# Altium schematic sheet Mainboard_Motordriver_Interface.SchDoc
size A4
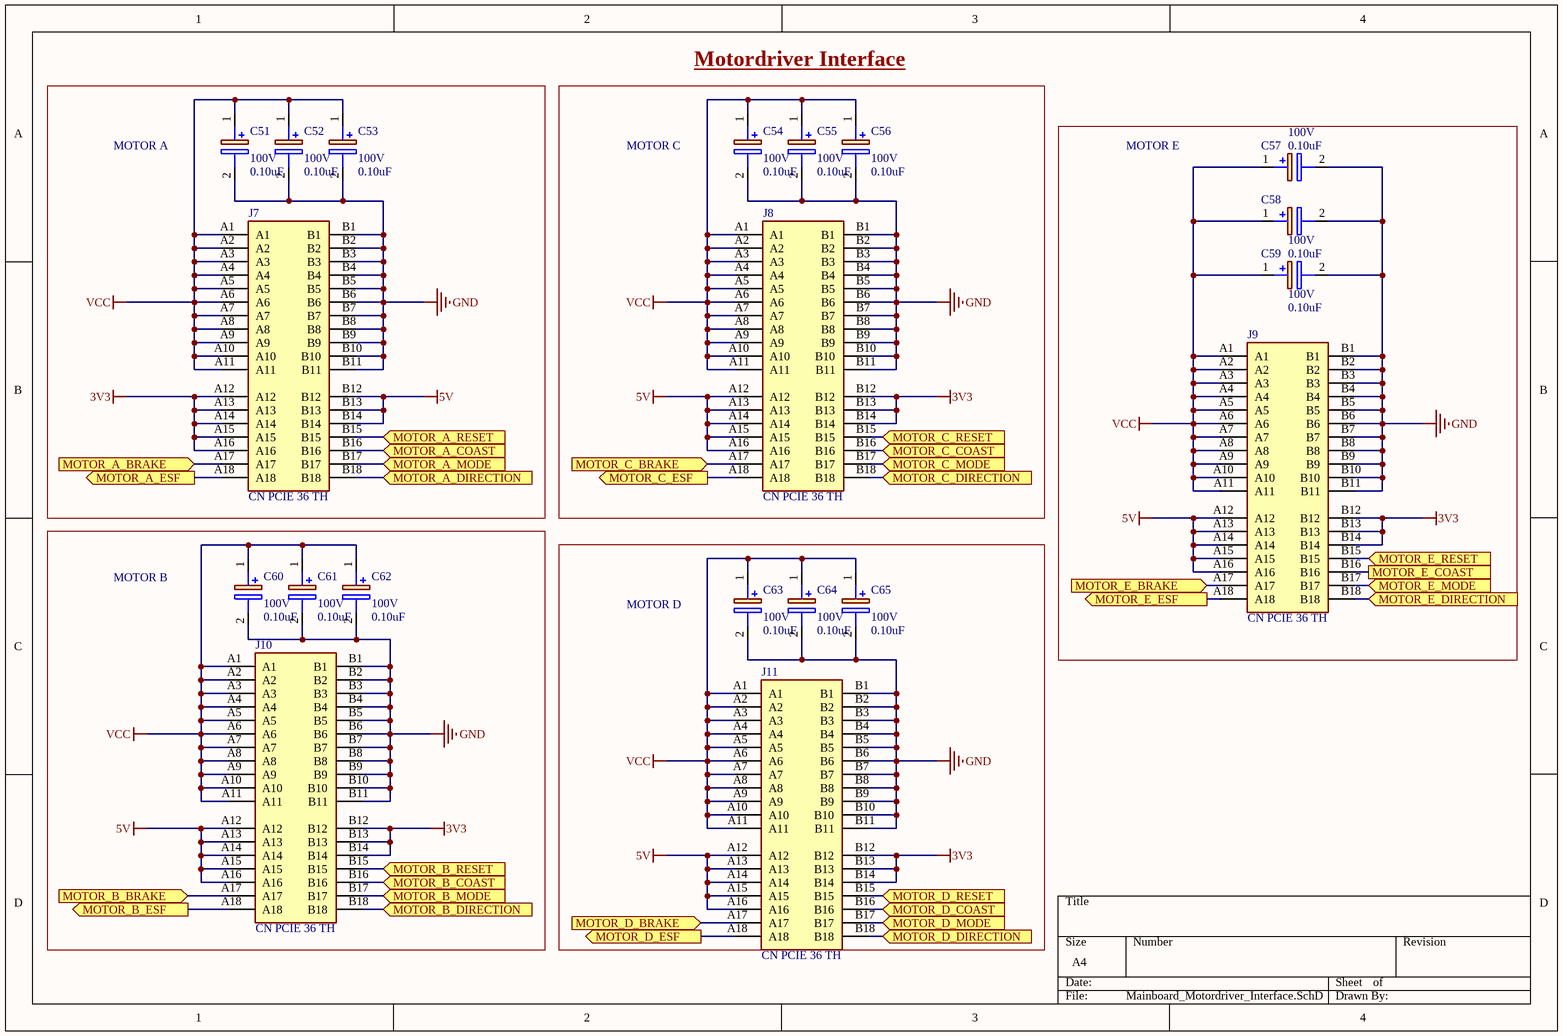
[diagram p0: Mainboard_Motordriver_Interface.SchDoc]

## Parts
C51  value 0.10uF  Rating: 100V  [0603]  (hidden comment: CAP POL 0.1uF 100V)
C52  value 0.10uF  Rating: 100V  [0603]  (hidden comment: CAP POL 0.1uF 100V)
C53  value 0.10uF  Rating: 100V  [0603]  (hidden comment: CAP POL 0.1uF 100V)
C54  value 0.10uF  Rating: 100V  [0603]  (hidden comment: CAP POL 0.1uF 100V)
C55  value 0.10uF  Rating: 100V  [0603]  (hidden comment: CAP POL 0.1uF 100V)
C56  value 0.10uF  Rating: 100V  [0603]  (hidden comment: CAP POL 0.1uF 100V)
C57  value 0.10uF  Rating: 100V  [0603]  (hidden comment: CAP POL 0.1uF 100V)
C58  value 0.10uF  Rating: 100V  [0603]  (hidden comment: CAP POL 0.1uF 100V)
C59  value 0.10uF  Rating: 100V  [0603]  (hidden comment: CAP POL 0.1uF 100V)
C60  value 0.10uF  Rating: 100V  [0603]  (hidden comment: CAP POL 0.1uF 100V)
C61  value 0.10uF  Rating: 100V  [0603]  (hidden comment: CAP POL 0.1uF 100V)
C62  value 0.10uF  Rating: 100V  [0603]  (hidden comment: CAP POL 0.1uF 100V)
C63  value 0.10uF  Rating: 100V  [0603]  (hidden comment: CAP POL 0.1uF 100V)
C64  value 0.10uF  Rating: 100V  [0603]  (hidden comment: CAP POL 0.1uF 100V)
C65  value 0.10uF  Rating: 100V  [0603]  (hidden comment: CAP POL 0.1uF 100V)
J7  CN PCIE 36 TH  [CN PCIE 36 TH]
J8  CN PCIE 36 TH  [CN PCIE 36 TH]
J9  CN PCIE 36 TH  [CN PCIE 36 TH]
J10  CN PCIE 36 TH  [CN PCIE 36 TH]
J11  CN PCIE 36 TH  [CN PCIE 36 TH]

## Blocks framed on the sheet
MOTOR A: C51-C53 J7
Motordriver Interface: C54-C56 J8
MOTOR E: C57-C59 J9
MOTOR B: C60-C62 J10
MOTOR D: C63-C65 J11

## Ports
MOTOR_A_BRAKE (in), MOTOR_A_COAST (in), MOTOR_A_DIRECTION (in), MOTOR_A_ESF (out), MOTOR_A_MODE (in), MOTOR_A_RESET (in), MOTOR_B_BRAKE (in), MOTOR_B_COAST (in), MOTOR_B_DIRECTION (in), MOTOR_B_ESF (out), MOTOR_B_MODE (in), MOTOR_B_RESET (in), MOTOR_C_BRAKE (in), MOTOR_C_COAST (in), MOTOR_C_DIRECTION (in), MOTOR_C_ESF (out), MOTOR_C_MODE (in), MOTOR_C_RESET (in), MOTOR_D_BRAKE (in), MOTOR_D_COAST (in), MOTOR_D_DIRECTION (in), MOTOR_D_ESF (out), MOTOR_D_MODE (in), MOTOR_D_RESET (in), MOTOR_E_BRAKE (in), MOTOR_E_COAST, MOTOR_E_DIRECTION (in), MOTOR_E_ESF (out), MOTOR_E_MODE (in), MOTOR_E_RESET (in)

## Nets
3V3: J7.A12 J7.A13 J7.A14 J7.A15 J7.A16 J8.B12 J8.B13 J8.B14 J9.B12 J9.B13 J9.B14 J10.B12 J10.B13 J10.B14 J11.B12 J11.B13 J11.B14
5V: J7.B12 J7.B13 J7.B14 J8.A12 J8.A13 J8.A14 J8.A15 J8.A16 J9.A12 J9.A13 J9.A14 J9.A15 J9.A16 J10.A12 J10.A13 J10.A14 J10.A15 J10.A16 J11.A12 J11.A13 J11.A14 J11.A15 J11.A16
GND: C51.2(-) C52.2(-) C53.2(-) C54.2(-) C55.2(-) C56.2(-) C57.2(-) C58.2(-) C59.2(-) C60.2(-) C61.2(-) C62.2(-) C63.2(-) C64.2(-) C65.2(-) J7.B1 J7.B2 J7.B3 J7.B4 J7.B5 J7.B6 J7.B7 J7.B8 J7.B9 J7.B10 J7.B11 J8.B1 J8.B2 J8.B3 J8.B4 J8.B5 J8.B6 J8.B7 J8.B8 J8.B9 J8.B10 J8.B11 J9.B1 J9.B2 J9.B3 J9.B4 J9.B5 J9.B6 J9.B7 J9.B8 J9.B9 J9.B10 J9.B11 J10.B1 J10.B2 J10.B3 J10.B4 J10.B5 J10.B6 J10.B7 J10.B8 J10.B9 J10.B10 J10.B11 J11.B1 J11.B2 J11.B3 J11.B4 J11.B5 J11.B6 J11.B7 J11.B8 J11.B9 J11.B10 J11.B11
VCC: C51.1(+) C52.1(+) C53.1(+) C54.1(+) C55.1(+) C56.1(+) C57.1(+) C58.1(+) C59.1(+) C60.1(+) C61.1(+) C62.1(+) C63.1(+) C64.1(+) C65.1(+) J7.A1 J7.A2 J7.A3 J7.A4 J7.A5 J7.A6 J7.A7 J7.A8 J7.A9 J7.A10 J7.A11 J8.A1 J8.A2 J8.A3 J8.A4 J8.A5 J8.A6 J8.A7 J8.A8 J8.A9 J8.A10 J8.A11 J9.A1 J9.A2 J9.A3 J9.A4 J9.A5 J9.A6 J9.A7 J9.A8 J9.A9 J9.A10 J9.A11 J10.A1 J10.A2 J10.A3 J10.A4 J10.A5 J10.A6 J10.A7 J10.A8 J10.A9 J10.A10 J10.A11 J11.A1 J11.A2 J11.A3 J11.A4 J11.A5 J11.A6 J11.A7 J11.A8 J11.A9 J11.A10 J11.A11
MOTOR_A_BRAKE: J7.A17 ; port MOTOR_A_BRAKE
MOTOR_A_COAST: J7.B16 ; port MOTOR_A_COAST
MOTOR_A_DIRECTION: J7.B18 ; port MOTOR_A_DIRECTION
MOTOR_A_ESF: J7.A18 ; port MOTOR_A_ESF
MOTOR_A_MODE: J7.B17 ; port MOTOR_A_MODE
MOTOR_A_RESET: J7.B15 ; port MOTOR_A_RESET
MOTOR_B_BRAKE: J10.A17 ; port MOTOR_B_BRAKE
MOTOR_B_COAST: J10.B16 ; port MOTOR_B_COAST
MOTOR_B_DIRECTION: J10.B18 ; port MOTOR_B_DIRECTION
MOTOR_B_ESF: J10.A18 ; port MOTOR_B_ESF
MOTOR_B_MODE: J10.B17 ; port MOTOR_B_MODE
MOTOR_B_RESET: J10.B15 ; port MOTOR_B_RESET
MOTOR_C_BRAKE: J8.A17 ; port MOTOR_C_BRAKE
MOTOR_C_COAST: J8.B16 ; port MOTOR_C_COAST
MOTOR_C_DIRECTION: J8.B18 ; port MOTOR_C_DIRECTION
MOTOR_C_ESF: J8.A18 ; port MOTOR_C_ESF
MOTOR_C_MODE: J8.B17 ; port MOTOR_C_MODE
MOTOR_C_RESET: J8.B15 ; port MOTOR_C_RESET
MOTOR_D_BRAKE: J11.A17 ; port MOTOR_D_BRAKE
MOTOR_D_COAST: J11.B16 ; port MOTOR_D_COAST
MOTOR_D_DIRECTION: J11.B18 ; port MOTOR_D_DIRECTION
MOTOR_D_ESF: J11.A18 ; port MOTOR_D_ESF
MOTOR_D_MODE: J11.B17 ; port MOTOR_D_MODE
MOTOR_D_RESET: J11.B15 ; port MOTOR_D_RESET
MOTOR_E_BRAKE: J9.A17 ; port MOTOR_E_BRAKE
MOTOR_E_COAST: J9.B16 ; port MOTOR_E_COAST
MOTOR_E_DIRECTION: J9.B18 ; port MOTOR_E_DIRECTION
MOTOR_E_ESF: J9.A18 ; port MOTOR_E_ESF
MOTOR_E_MODE: J9.B17 ; port MOTOR_E_MODE
MOTOR_E_RESET: J9.B15 ; port MOTOR_E_RESET

## Notes on the sheet
- MOTOR C

## Library data of the parts
C51-C65 = CAP POL 0.1uF 100V: 0.1µF 100V Aluminum Electrolytic Capacitors, Through-Hole, Radial, Can 2000 Hrs @ 85°C; Manufacturer_Name: Nichicon; Manufacturer_Part_Number: UKL2A0R1KDD; Datasheet Link: http://www.mouser.com/ds/2/293/e-ukl-876305.pdf; Height: 12.5mm; Mouser Part Number: 647-UKL2A0R1KDD; Mouser Price/Stock: https://www.mouser.com/Search/Refine.aspx?Keyword=647-UKL2A0R1KDD; Supplier 1: Digi-Key; Supplier Part Number 1: 493-16876-ND
J7-J11 = CN PCIE 36 TH: 36 Position Female Connector PCI Expressâ„¢ Gold 0.039 _1.00mm_ Black 10018784-10210TLF; MF: Amphenol ICC; Price: None; SnapEDA_Link: https://www.snapeda.com/parts/10018784-10210TLF/Amphenol%20FCI/view-part/520950/?ref=snap; Availability: Unavailable; MP: 10018784-10210TLF; Package: None; Value: *